# Altium schematic sheet 02 - PowerSupply.SchDoc
size A4; DocumentNumber: 1; SheetNumber: 1; SheetTotal: 3; SchemaTitle: Power Supply

## Notes on the sheet
- Schema Title:
- Project:
- PCB-No.:
- Author:
- Co-Author:
- Revision:
- PCB Name:
- Customer:
- Variant:
- Reviewer:
- Checked by:
- Date:
- Time:
- Sheet:
- of
- Doc Name:
- A4